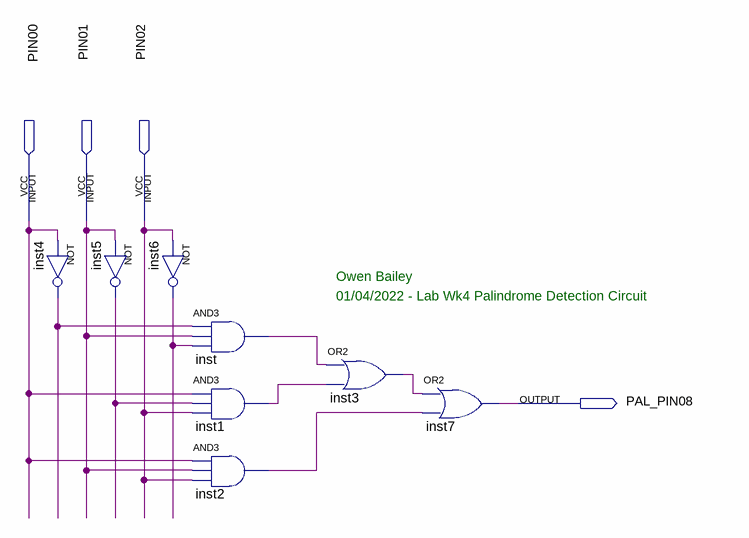
[diagram p0: schematic sheet]
// Quartus schematic palindrome.bdf as structural Verilog: 8 symbols, 4 pins
module palindrome (
  input  PIN00,
  input  PIN01,
  input  PIN02,
  output PAL_PIN08
);

  wire inst1_out, inst2_out, inst3_out, inst4_out, inst5_out, inst6_out, inst_out;

  not inst4 (inst4_out, PIN00);
  not inst5 (inst5_out, PIN01);
  not inst6 (inst6_out, PIN02);
  and inst (inst_out, inst4_out, PIN01, inst6_out);
  and inst1 (inst1_out, PIN00, inst5_out, PIN02);
  and inst2 (inst2_out, PIN00, PIN01, PIN02);
  or inst3 (inst3_out, inst_out, inst1_out);
  or inst7 (PAL_PIN08, inst3_out, inst2_out);

  // Notes on the sheet:
  //   Owen Bailey
  //   01/04/2022 - Lab Wk4 Palindrome Detection Circuit
endmodule
